# Altium schematic sheet Power.SchDoc
size A4
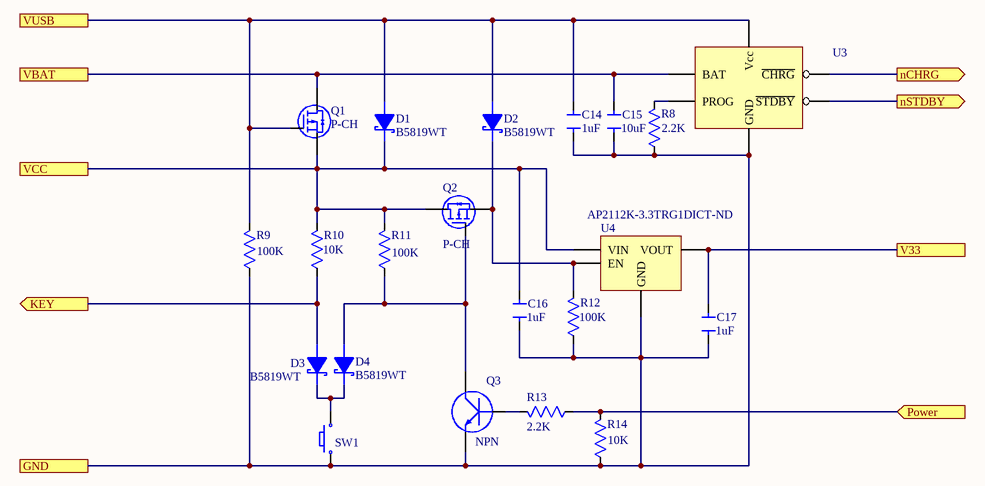
[diagram p0: Power.SchDoc]

## Parts
C14  value 1uF  [CAP_0402]  (hidden comment: Cap)
C15  value 10uF  [Cap_0603]  (hidden comment: Cap)
C16  value 1uF  [CAP_0402]  (hidden comment: Cap)
C17  value 1uF  [CAP_0402]  (hidden comment: Cap)
D1  B5819WT  [SOD-523]
D2  B5819WT  [SOD-523]
D3  B5819WT  [SOD-523]
D4  B5819WT  [SOD-523]
Q1  Polarity: P-CH  [SOT-23]  (hidden comment: SI2301DS-T1)
Q2  Polarity: P-CH  [SOT-23]  (hidden comment: SI2301DS-T1)
Q3  Polarity: NPN  [SOT-23]  (hidden comment: MMS9013L-TP)
R8  value 2.2K  [RES_0402]  (hidden comment: Res)
R9  value 100K  [RES_0402]  (hidden comment: Res)
R10  value 10K  [RES_0402]  (hidden comment: Res)
R11  value 100K  [RES_0402]  (hidden comment: Res)
R12  value 100K  [RES_0402]  (hidden comment: Res)
R13  value 2.2K  [RES_0402]  (hidden comment: Res)
R14  value 10K  [RES_0402]  (hidden comment: Res)
SW1  SPST  [ST01-111]  (value not drawn)
U3  TP4059  [SOT23-6]  (value not drawn)
U4  Supplier Part Number 1: AP2112K-3.3TRG1DICT-ND  [SOT23-5]  (hidden comment: AP2112K-3.3TRG1)

## Ports
GND, KEY (out), nCHRG (out), nSTDBY (out), Power (in), V33, VBAT, VCC, VUSB

## Nets
GND: C14.2 C15.2 C16.2 C17.2 Q3.3 R8.2 R9.2 R12.2 R14.2 SW1.2 U3.4(GND) U4.3(GND) ; port GND
KEY: D3.1 R10.2 ; port KEY
nCHRG: U3.2(~{CHRG}) ; port nCHRG
nSTDBY: U3.3(~{STDBY}) ; port nSTDBY
Power: R13.2 R14.1 ; port Power
V33: C17.1 U4.4(VOUT) ; port V33
VBAT: C15.1 Q1.1 U3.6(BAT) ; port VBAT
VCC: C16.1 D1.2 Q1.3 Q2.1 R10.1 R11.1 U4.1(VIN) ; port VCC
VUSB: C14.1 D1.1 D2.1 Q1.2 R9.1 U3.1(Vcc) ; port VUSB
NetD2_2: D2.2 Q2.3 R12.1 U4.2(EN)
NetD3_2: D3.2 D4.2 SW1.1
NetD4_1: D4.1 Q2.2 Q3.1 R11.2
NetQ3_2: Q3.2 R13.1
NetR8_1: R8.1 U3.5(PROG)

## Library data of the parts
D1-D4 = B5819WT: Diode Schottky 40V 1A 2-Pin SOD-523 T/R; Manufacturer: MCC; Manufacturer Part Number: B5819W-TP; Max Reverse Voltage (DC): 20V; Element Configuration: Single; Forward Voltage: 550mV; Max Forward Surge Current (Ifsm): 10A; Peak Reverse Current: 1mA; Max Power Dissipation: 250mW; Supplier 1: Digi-Key; RoHS: Yes; Category: Rectifier Diodes; Stock 1: 1380; Pricing 1: 1=0.38000, 10=0.28000, 25=0.24520, 100=0.13300, 250=0.13232, 500=0.10850, 1000=0.08050 (USD); Mount: Surface Mount; Min Operating Temperature: -65°C; Max Operating Temperature: 125°C; Reverse Voltage (DC): 40V; Average Rectified Current: 1A; Package Quantity: 3000; Packaging: Tape and Reel; Forward Current: 1A; Max Repetitive Reverse Voltage (Vrrm): 40V; ComponentLink1URL: https://datasheet.ciiva.com/6378/b5817w-b5819wsod-123-6378255.pdf?src-supplier=Digi-Key; ComponentLink1Description: https://datasheet.ciiva.com/6378/b5817w-b5819wsod-123-6378255.pdf?src-supplier=Digi-Key; Supplier Part Number 1: B5819WT
Q1 Q2 = SI2301DS-T1: Trans MOSFET P-CH 20V 2.3A 3-Pin TO-236 T/R; pin to pad: 1>2 2>1; Manufacturer: Vishay Siliconix; Rise Time: 36ns; Drain to Source Resistance: 130mR; Gate to Source Voltage (Vgs): 8V; Max Power Dissipation: 1.25W; Turn-Off Delay Time: 42ns; Turn-On Delay Time: 13ns; Number of Elements: 1; Element Configuration: Single; Drain to Source Voltage (Vdss): -20V; Supplier 1: Component Sense; Manufacturer Part Number: SI2301DS-T1; RoHS: No; Category: MOSFETs; Stock 1: 12531; Pricing 1: 143=0.17500, 500=0.15000, 1000=0.10000, 5000=0.09000, 10000=0.08000 (USD); Mount: Surface Mount; Case/Package: SOT-23-3; Number of Pins: 3; Weight: 0.050717oz; Min Operating Temperature: -55°C; Max Operating Temperature: 150°C; Packaging: Tape and Reel; Package Quantity: 3000; Continuous Drain Current (ID): 2.3A; Fall Time: 36ns; Power Dissipation: 1.25W; Number of Channels: 1; Length: 3.04mm; Height: 1.02mm; Width: 1.4mm; ComponentLink1URL: https://datasheet.ciiva.com/13048/70627-115154-13048148.pdf?src-supplier=Mouser; ComponentLink1Description: https://datasheet.ciiva.com/13048/70627-115154-13048148.pdf?src-supplier=Mouser; Supplier Part Number 1: SI2301DS-T1
Q3 = MMS9013L-TP: Trans GP BJT NPN 25V 0.5A 3-Pin SOT-23 T/R; pin to pad: 1>3 2>1 3>2; Manufacturer: MCC; Frequency: 150MHz; Number of Elements: 1; Collector Base Voltage (VCBO): 40V; Emitter Base Voltage (VEBO): 5V; Power Dissipation: 300mW; Manufacturer Part Number: MMS9013L-TP; RoHS: Yes; Category: BJTs; Mount: Surface Mount; Case/Package: SOT-23; Number of Pins: 3; Min Operating Temperature: -55°C; Max Operating Temperature: 150°C; Packaging: Tape and Reel; Collector Emitter Voltage (VCEO): 25V; ComponentLink1URL: http://components.arrow.com/part/dataview/51062823S110403N2022?src-supplier=Arrow; ComponentLink1Description: http://components.arrow.com/part/dataview/51062823S110403N2022?src-supplier=Arrow; Supplier 1: Arrow; Supplier Part Number 1: MMS9013-L-TP
SW1 = Switch_Button1
U3 = TP4059: 600MA SOT23-6; pin to pad: 1>4 2>1 3>5 4>2 5>6 6>3; ComponentLink1Description: Datasheet; ComponentLink1URL: http://www.tp-asic.com/res/tp-asic/pdres/201403/TP4059.pdf
U4 = AP2112K-3.3TRG1: IC REG LINEAR 3.3V 600MA SOT23-5; pin to pad: 2>3 3>2 4>5; Manufacturer: Diodes; Number of Regulators: 1; Quiescent Current: 55uA; Polarity: Positive; Max Input Voltage: 6V; Min Input Voltage: 2.5V; Accuracy: 1.5%; Dropout Voltage: 250mV; Output Type: Fixed; Supplier 1: Digi-Key; Manufacturer Part Number: AP2112K-3.3TRG1; RoHS: Yes; Category: Voltage Regulators - Linear; Stock 1: 54786; Pricing 1: 1=0.47000, 10=0.35500, 25=0.32000, 100=0.17450, 250=0.16872, 500=0.15126, 1000=0.11636 (USD); Mount: Surface Mount; Case/Package: SOT-23-5; Number of Pins: 5; Min Operating Temperature: -40°C; Max Operating Temperature: 85°C; Output Current: 600mA; Max Output Current: 600mA; Output Voltage: 3.3V; Number of Outputs: 1; Package Quantity: 1; Packaging: Tape and Reel; Length: 3.1mm; Height: 1.3mm; Width: 1.7mm; Lead Free: Lead Free; ComponentLink1URL: https://datasheet.ciiva.com/29569/ap2112-29569919.pdf?src-supplier=Digi-Key; ComponentLink1Description: https://datasheet.ciiva.com/29569/ap2112-29569919.pdf?src-supplier=Digi-Key; ComponentLink2URL: https://datasheet.ciiva.com/30016/ap2112-30016792.pdf?src-supplier=Avnet; ComponentLink2Description: https://datasheet.ciiva.com/30016/ap2112-30016792.pdf?src-supplier=Avnet; ComponentLink3URL: https://datasheet.ciiva.com/29569/ap2112-29569917.pdf?src-supplier=Digi-Key; ComponentLink3Description: https://datasheet.ciiva.com/29569/ap2112-29569917.pdf?src-supplier=Digi-Key; ComponentLink4URL: https://datasheet.ciiva.com/29569/ap2112-29569918.pdf?src-supplier=Digi-Key; ComponentLink4Description: https://datasheet.ciiva.com/29569/ap2112-29569918.pdf?src-supplier=Digi-Key